# EAGLE design SparkFun_GPS_ZED-F9R_pHat (EAGLE 9.5.2)
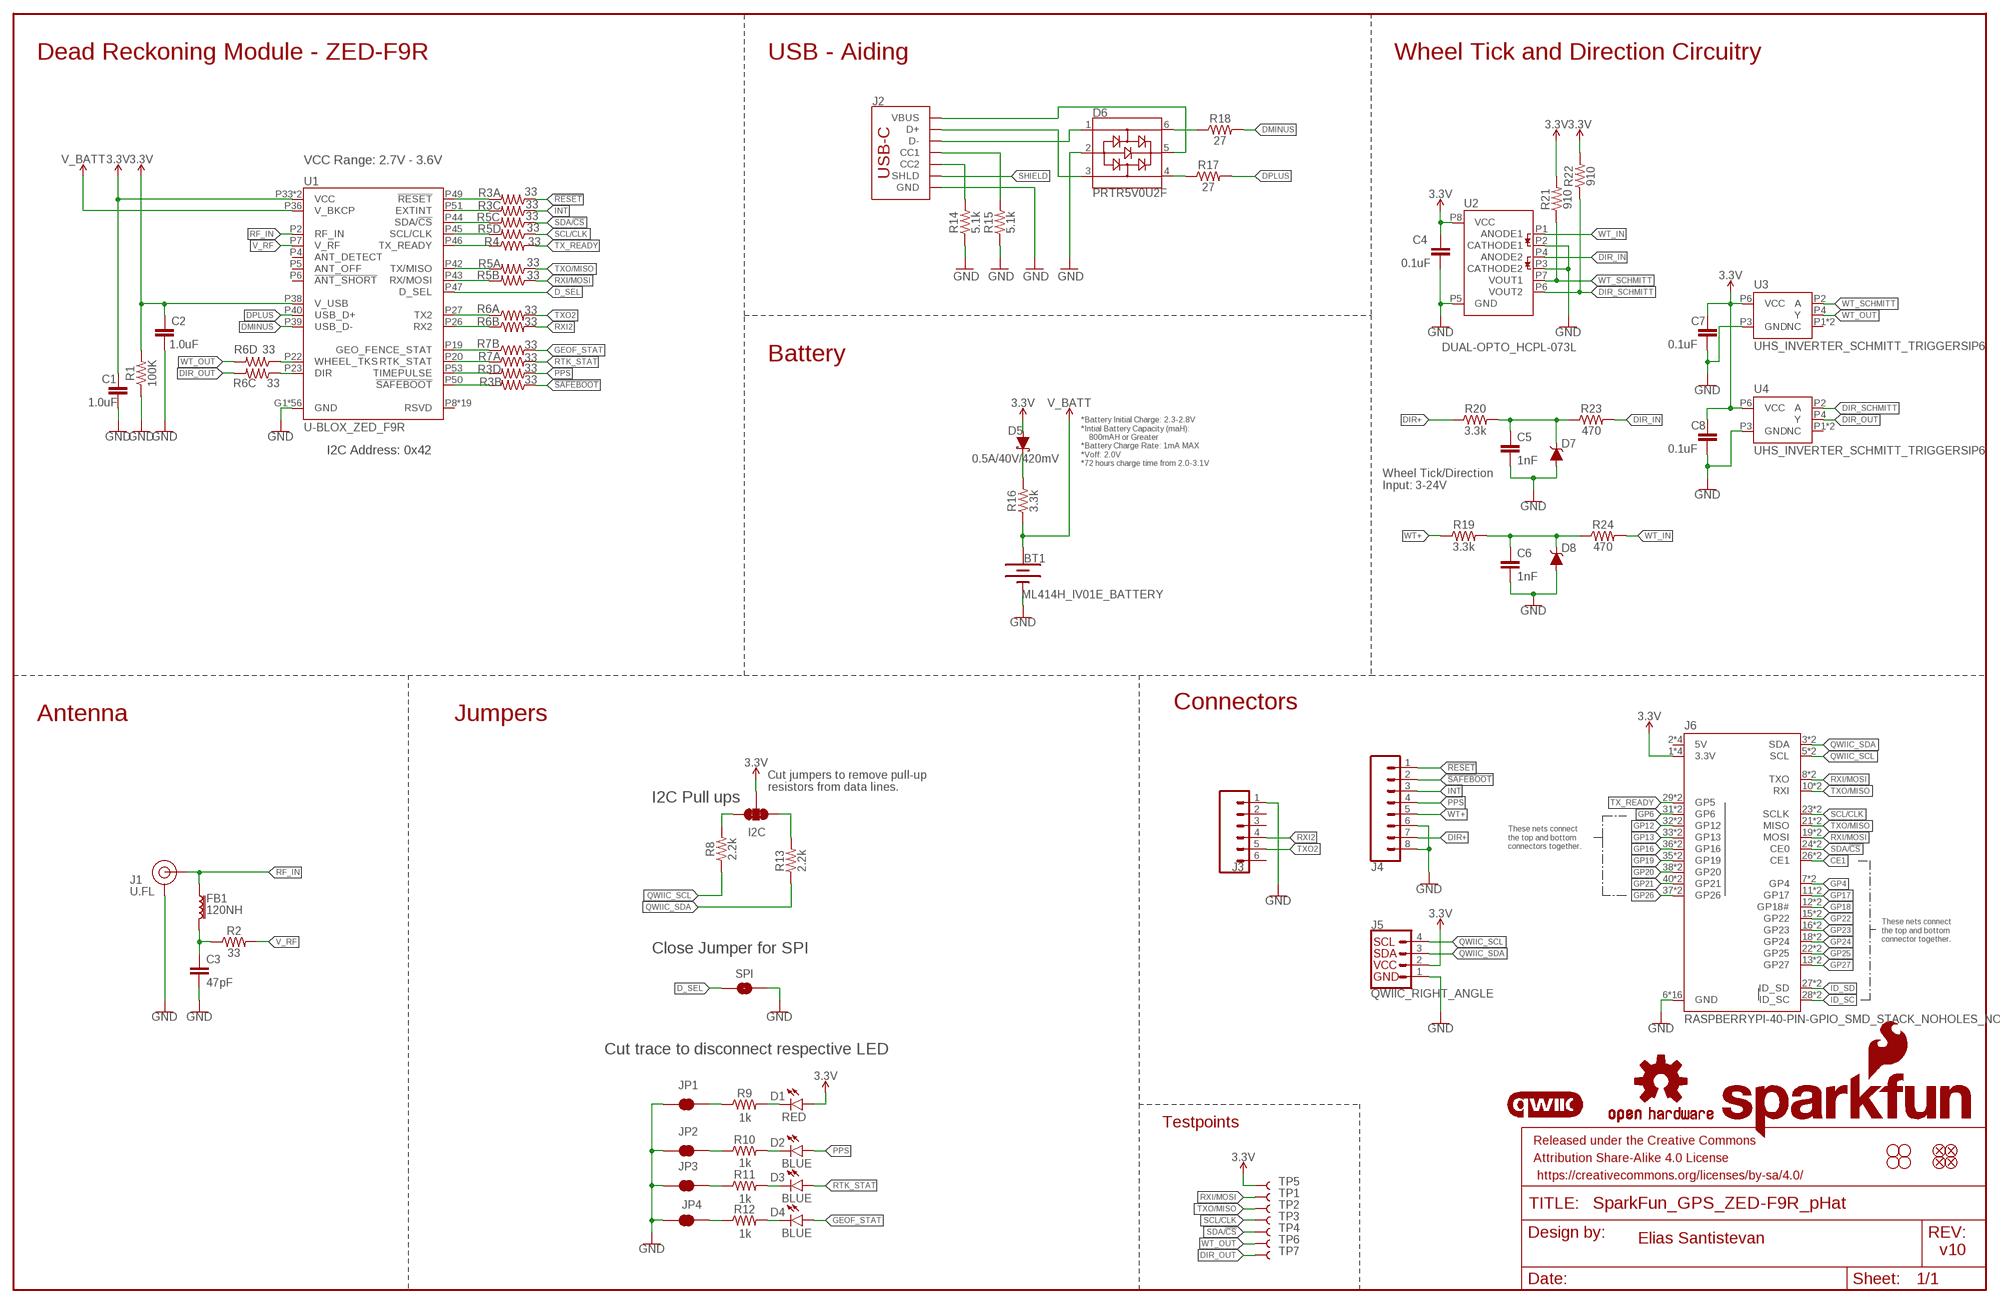
[diagram p0: schematic, sheet 1]

## Parts
BT1  ML414H_IV01E_BATTERY  [ML414H_IV01E]
C1  1.0uF  1.0UF-0402-16V-10%  [0402]
C2  1.0uF  1.0UF-0402-16V-10%  [0402]
C3  47pF  47PF-0402-25V-5%-X7R  [0402]
C4  0.1uF  0.1UF-0402-10V-10%-X7R  [0402]
C5  1nF  1.0NF/1000PF-0402-25V-10%-X7R  [0402]
C6  1nF  1.0NF/1000PF-0402-25V-10%-X7R  [0402]
C7  0.1uF  0.1UF-0402-10V-10%-X7R  [0402]
C8  0.1uF  0.1UF-0402-10V-10%-X7R  [0402]
D1  RED  LED-RED0603  [LED-0603]
D2  BLUE  LED-BLUE0603  [LED-0603]
D3  BLUE  LED-BLUE0603  [LED-0603]
D4  BLUE  LED-BLUE0603  [LED-0603]
D5  0.5A/40V/420mV  DIODE-SCHOTTKY-PMEG4005EJ  [SOD-323]
D6  PRTR5V0U2F  [SOT886]
D7  15V  DIODE-ZENER-BZX84C15LT3G  [SOT23-3]
D8  15V  DIODE-ZENER-BZX84C15LT3G  [SOT23-3]
FB1  120NH  FERRITE_BEAD_GNSS  [0402_MURATA]
FD1  FIDUCIALUFIDUCIAL  [FIDUCIAL-MICRO]
FD2  FIDUCIALUFIDUCIAL  [FIDUCIAL-MICRO]
FD3  FIDUCIALUFIDUCIAL  [FIDUCIAL-MICRO]
FD4  FIDUCIALUFIDUCIAL  [FIDUCIAL-MICRO]
FRAME1  FRAME-LEDGER  [CREATIVE_COMMONS]
H1  STAND-OFFTIGHT  [STAND-OFF-TIGHT]
H2  STAND-OFFTIGHT  [STAND-OFF-TIGHT]
H3  STAND-OFFTIGHT  [STAND-OFF-TIGHT]
H4  STAND-OFFTIGHT  [STAND-OFF-TIGHT]
J1  U.FL  U.FL2PIN  [U.FL]
J2  USB_C_2-LAYER  [USB-C-16P]
J3  CONN_06NO_SILK_NO_POP  [1X06_NO_SILK]
J4  CONN_08NO_SILK_FEMALE_PTH  [1X08_NO_SILK]
J5  QWIIC_RIGHT_ANGLE  QWIIC_CONNECTORJS-1MM  [JST04_1MM_RA]
J6  RASPBERRYPI-40-PIN-GPIO_SMD_STACK_NOHOLES_NOREF  [RASPBERRY_PI_HAT_40_PIN_SMD_STACKABLE_NOHOLES_NOREF]
JP1  JUMPER-SMT_2_NC_TRACE_SILK  [SMT-JUMPER_2_NC_TRACE_SILK]
JP2  JUMPER-SMT_2_NC_TRACE_SILK  [SMT-JUMPER_2_NC_TRACE_SILK]
JP3  JUMPER-SMT_2_NC_TRACE_SILK  [SMT-JUMPER_2_NC_TRACE_SILK]
JP4  JUMPER-SMT_2_NC_TRACE_SILK  [SMT-JUMPER_2_NC_TRACE_SILK]
JP5  JUMPER-SMT_2_NO_SILK  [SMT-JUMPER_2_NO_SILK]
JP6  JUMPER-SMT_3_2-NC_TRACE_SILK  [SMT-JUMPER_3_2-NC_TRACE_SILK]
LOGO1  QWIIC_LOGO_5MM  [QWIIC_5MM]
LOGO2  OSHW-LOGOM  [OSHW-LOGO-M]
LOGO3  SFE_LOGO_NAME_FLAME.2_INCH  [SFE_LOGO_NAME_FLAME_.2]
R1  100K  100KOHM-0402-1/16W-1%  [0402]
R2  33  33OHM-0603-1/10W-1%  [0603]
R3  33  33OHM_RA-1206-1/16W-5%  [1206_RA]
R4  33  33OHM-0603-1/10W-1%  [0603]
R5  33  33OHM_RA-1206-1/16W-5%  [1206_RA]
R6  33  33OHM_RA-1206-1/16W-5%  [1206_RA]
R7  33  33OHM_RA-1206-1/16W-5%  [1206_RA]
R8  2.2k  2.2KOHM-0603-1/10W-1%  [0603]
R9  1k  1KOHM-0603-1/10W-1%  [0603]
R10  1k  1KOHM-0603-1/10W-1%  [0603]
R11  1k  1KOHM-0603-1/10W-1%  [0603]
R12  1k  1KOHM-0603-1/10W-1%  [0603]
R13  2.2k  2.2KOHM-0603-1/10W-1%  [0603]
R14  5.1k  5.1KOHM-0402-1/16W-1%  [0402]
R15  5.1k  5.1KOHM-0402-1/16W-1%  [0402]
R16  3.3k  3.3KOHM-0603-1/10W-1%  [0603]
R17  27  27OHM-0603-1/10W-1%  [0603]
R18  27  27OHM-0603-1/10W-1%  [0603]
R19  3.3k  3.3KOHM-0603-1/10W-1%  [0603]
R20  3.3k  3.3KOHM-0603-1/10W-1%  [0603]
R21  910  910OHM-0603-1/10W-5%  [0603]
R22  910  910OHM-0603-1/10W-5%  [0603]
R23  470  470OHM-0603-1/10W-1%  [0603]
R24  470  470OHM-0603-1/10W-1%  [0603]
TP1  TEST-POINT3X4  [PAD.03X.04]
TP2  TEST-POINT3X4  [PAD.03X.04]
TP3  TEST-POINT3X4  [PAD.03X.04]
TP4  TEST-POINT3X4  [PAD.03X.04]
TP5  TEST-POINT3X4  [PAD.03X.04]
TP6  TEST-POINT3X4  [PAD.03X.04]
TP7  TEST-POINT3X4  [PAD.03X.04]
U1  U-BLOX_ZED_F9R  [UBLOX_ZED_F9R]
U2  DUAL-OPTO_HCPL-073L  [SOP_8-PIN]
U3  UHS_INVERTER_SCHMITT_TRIGGERSIP6  [SIP6]
U4  UHS_INVERTER_SCHMITT_TRIGGERSIP6  [SIP6]

## Nets
3.3V: C1.1 C2.1 C4.1 C7.1 C8.1 D1.A D5.A J5.2 J6.1(3.3V) J6.1B(3.3V) J6.17(3.3V) J6.17B(3.3V) JP6.2 R1.2 R21.2 R22.2 TP5.P$1 U1.P33(VCC) U1.P34(VCC) U1.P38(V_USB) U2.P8(VCC) U3.P6(VCC) U4.P6(VCC)
!RESET: J4.1 R3.P1
!SAFEBOOT: J4.2 R3.P2
CE1: J6.26(CE1) J6.26B(CE1)
D_SEL: JP5.1 U1.P47(D_SEL)
DIR+: J4.7 R20.1
DIR_IN: R23.2 U2.P4(ANODE2)
DIR_OUT: R6.P6 TP7.P$1 U4.P4(Y)
DIR_SCHMITT: R22.1 U2.P6(VOUT2) U4.P2(A)
DMINUS: R18.2 U1.P39(USB_D-)
DPLUS: R17.2 U1.P40(USB_D+)
GEOF_STAT: D4.A R7.P7
GND: BT1.- C1.2 C2.2 C3.2 C4.2 C5.2 C6.2 C7.2 C8.2 D6.2 D7.1(A) D8.1(A) J1.1(GND) J1.2(GND) J2.GND J2.GND2(GND) J3.1 J4.6 J4.8 J5.1 J6.6(GND) J6.6B(GND) J6.9(GND) J6.9B(GND) J6.14(GND) J6.14B(GND) J6.20(GND) J6.20B(GND) J6.25(GND) J6.25B(GND) J6.30(GND) J6.30B(GND) J6.34(GND) J6.34B(GND) J6.39(GND) J6.39B(GND) JP1.1 JP2.1 JP3.1 JP4.1 JP5.2 R1.1 R14.1 R15.1 U1.G1(GND) U1.G2(GND) U1.G3(GND) U1.G4(GND) U1.G5(GND) U1.G6(GND) U1.G7(GND) U1.G8(GND) U1.G9(GND) U1.G10(GND) U1.G11(GND) U1.G12(GND) U1.G13(GND) U1.G14(GND) U1.G15(GND) U1.G16(GND) U1.G17(GND) U1.G18(GND) U1.G19(GND) U1.G20(GND) U1.G21(GND) U1.G22(GND) U1.G23(GND) U1.G24(GND) U1.G25(GND) U1.G26(GND) U1.G27(GND) U1.G28(GND) U1.G29(GND) U1.G30(GND) U1.G31(GND) U1.G32(GND) U1.G33(GND) U1.G34(GND) U1.G35(GND) U1.G36(GND) U1.G37(GND) U1.G38(GND) U1.G39(GND) U1.G40(GND) U1.G41(GND) U1.G42(GND) U1.G43(GND) U1.G44(GND) U1.G45(GND) U1.G46(GND) U1.G47(GND) U1.G48(GND) U1.P1(GND) U1.P3(GND) U1.P12(GND) U1.P14(GND) U1.P32(GND) U1.P37(GND) U1.P41(GND) U1.P48(GND) U2.P2(CATHODE1) U2.P3(CATHODE2) U2.P5(GND) U3.P3(GND) U4.P3(GND)
GP4: J6.7(GP4) J6.7B(GP4)
GP6: J6.31(GP6) J6.31B(GP6)
GP12: J6.32(GP12) J6.32B(GP12)
GP13: J6.33(GP13) J6.33B(GP13)
GP16: J6.36(GP16) J6.36B(GP16)
GP17: J6.11(GP17) J6.11B(GP17)
GP18: J6.12(GP18#) J6.12B(GP18#)
GP19: J6.35(GP19) J6.35B(GP19)
GP20: J6.38(GP20) J6.38B(GP20)
GP21: J6.40(GP21) J6.40B(GP21)
GP22: J6.15(GP22) J6.15B(GP22)
GP23: J6.16(GP23) J6.16B(GP23)
GP24: J6.18(GP24) J6.18B(GP24)
GP25: J6.22(GP25) J6.22B(GP25)
GP26: J6.37(GP26) J6.37B(GP26)
GP27: J6.13(GP27) J6.13B(GP27)
ID_SC: J6.28(ID_SC) J6.28B(ID_SC)
ID_SD: J6.27(ID_SD) J6.27B(ID_SD)
INT: J4.3 R3.P3
N$1: JP6.1 R13.2
N$2: D5.C R16.2
N$3: JP6.3 R8.2
N$4: D1.C R9.2
N$5: C3.1 FB1.P2 R2.1
N$6: D6.6 R18.1
N$7: D6.4 R17.1
N$8: JP1.2 R9.1
N$9: D6.3 J2.A6(D+) J2.B6(D+)
N$10: D6.5 J2.VBUS1(VBUS) J2.VBUS2(VBUS)
N$11: D6.1 J2.A7(D-) J2.B7(D-)
N$12: J2.B5(CC2) R14.2
N$13: R3.P8 U1.P49(!RESET!)
N$14: R3.P6 U1.P51(EXTINT)
N$15: R5.P6 U1.P44(SDA/!CS!)
N$16: JP4.2 R12.1
N$17: D4.C R12.2
N$18: J2.A5(CC1) R15.2
N$19: R5.P5 U1.P45(SCL/CLK)
N$20: R4.1 U1.P46(TX_READY)
N$21: R5.P8 U1.P42(TX/MISO)
N$22: JP3.2 R11.1
N$23: JP2.2 R10.1
N$24: D2.C R10.2
N$25: D3.C R11.2
N$26: R5.P7 U1.P43(RX/MOSI)
N$27: C6.1 D8.3(C) R19.2 R24.1
N$28: R7.P2 U1.P19(GEO_FENCE_STAT)
N$29: R7.P1 U1.P20(RTK_STAT)
N$30: R3.P5 U1.P53(TIMEPULSE)
N$31: R3.P7 U1.P50(!SAFEBOOT!)
N$32: R6.P1 U1.P27(TX2)
N$33: R6.P2 U1.P26(RX2)
N$34: R6.P4 U1.P22(WHEEL_TKS)
N$35: R6.P3 U1.P23(DIR)
N$36: C5.1 D7.3(C) R20.2 R23.1
PPS: D2.A J4.4 R3.P4
QWIIC_SCL: J5.4 J6.5(SCL) J6.5B(SCL) R8.1
QWIIC_SDA: J5.3 J6.3(SDA) J6.3B(SDA) R13.1
RF_IN [Antenna]: FB1.P1 J1.FEED(SIGNAL) U1.P2(RF_IN)
RTK_STAT: D3.A R7.P8
RXI2: J3.4 R6.P7
RXI/MOSI: J6.8(TXO) J6.8B(TXO) J6.19(MOSI) J6.19B(MOSI) R5.P2 TP1.P$1
SCL/CLK: J6.23(SCLK) J6.23B(SCLK) R5.P4 TP3.P$1
SDA/!CS: J6.24(CE0) J6.24B(CE0) R5.P3 TP4.P$1
SHIELD: J2.SHLD1(SHLD) J2.SHLD2(SHLD) J2.SHLD3(SHLD) J2.SHLD4(SHLD) J2.SHLD5(SHLD) J2.SHLD6(SHLD) J2.SHLD7(SHLD) J2.SHLD8(SHLD)
TX_READY: J6.29(GP5) J6.29B(GP5) R4.2
TXO2: J3.5 R6.P8
TXO/MISO: J6.10(RXI) J6.10B(RXI) J6.21(MISO) J6.21B(MISO) R5.P1 TP2.P$1
V_BATT: BT1.+ R16.1 U1.P36(V_BKCP)
V_RF: R2.2 U1.P7(V_RF)
WT+: J4.5 R19.1
WT_IN: R24.2 U2.P1(ANODE1)
WT_OUT: R6.P5 TP6.P$1 U3.P4(Y)
WT_SCHMITT: R21.1 U2.P7(VOUT1) U3.P2(A)
Unconnected: J3.2 J3.3 J3.6 R7.P3 R7.P4 R7.P5 R7.P6 U1.P4(ANT_DETECT) U1.P5(ANT_OFF) U1.P6(!ANT_SHORT!) U1.P8(RSVD) U1.P9(RSVD) U1.P10(RSVD) U1.P11(RSVD) U1.P13(RSVD) U1.P15(RSVD) U1.P16(RSVD) U1.P17(RSVD) U1.P18(RSVD) U1.P21(RSVD) U1.P24(RSVD) U1.P25(RSVD) U1.P28(RSVD) U1.P29(RSVD) U1.P30(RSVD) U1.P31(RSVD) U1.P35(RSVD) U1.P52(RSVD) U1.P54(RSVD) U3.P1(NC) U3.P5(NC) U4.P1(NC) U4.P5(NC)

## Notes on the sheet
- Dead Reckoning Module - ZED-F9R | USB - Aiding | Wheel Tick and Direction Circuitry
- VCC Range: 2.7V - 3.6V
- Battery
- I2C Address: 0x42
- *Battery Initial Charge: 2.3-2.8V
  *Intial Battery Capacity (maH): 
      800mAH or Greater
  *Battery Charge Rate: 1mA MAX
  *Voff: 2.0V
  *72 hours charge time from 2.0-3.1V
- Wheel Tick/Direction
  Input: 3-24V
- Connectors
- Antenna | Jumpers
- Cut jumpers to remove pull-up
  resistors from data lines.
- I2C Pull ups
- I2C
- These nets connect
  the top and bottom
  connectors together.
- These nets connect 
  the top and bottom 
  connector together.
- Close Jumper for SPI
- SPI
- Cut trace to disconnect respective LED
- 1k
- Testpoints
- 1k
- 1k
- 1k
- Elias Santistevan
- v10

## Power pins joined to a net without a drawn wire
5V: J6.2(5V) J6.2B(5V) J6.4(5V) J6.4B(5V)

## Library data of the parts
BT1 = SparkFun-Batteries:ML414H_IV01E_BATTERY: SEIKO ML414H-IV01E Reflowable Lithium Battery ML414H is a rechargeable, coin type battery with features such as Pb-free reflowable (Peak temperature: 260 C) and high temperature heat resistance. Battery Characteristics: 3.1V max voltage Voff is 2V 1mAH 3k series resistor with battery 72 hour charge time from 2.0-3.1V 2.3-2.8V initial charge; PROD_ID: BATT-14267
C1 C2 = SparkFun-Capacitors:1.0UF: 1µF ceramic capacitors A capacitor is a passive two-terminal electrical component used to store electrical energy temporarily in an electric field.; PROD_ID: CAP-12417
C3 = SparkFun-Capacitors:47PF: 47pF ceramic capacitors A capacitor is a passive two-terminal electrical component used to store electrical energy temporarily in an electric field.; PROD_ID: CAP-15063
C4 C7 C8 = SparkFun-Capacitors:0.1UF: 0.1µF ceramic capacitors A capacitor is a passive two-terminal electrical component used to store electrical energy temporarily in an electric field.; PROD_ID: CAP-15083
C5 C6 = SparkFun-Capacitors:1.0NF/1000PF: 1nF/1,000pF ceramic capacitors A capacitor is a passive two-terminal electrical component used to store electrical energy temporarily in an electric field.; PROD_ID: CAP-15061
D1 = SparkFun-LED:LED-RED: Red SMD LED Used in manufacturing of most products at SparkFun Packages: 0603 - SMD 0603 package [Product Link] <http://docs.avagotech.com/docs/AV02-0551EN> 0603 SMART - SMD 0603 SMART package ( more efficient and expensive)[Product Link] <http://www.osram-os.com/Graphics/XPic2/00077099_0.pdf> 1206 - SMD1206 package [Product Link] <https://www.sparkfun.com/datasheets/DevTools/LilyPad/Q150OVS4.pdff> SparkFun Products: Pro Mini 328 -5V <https://www.sparkfun.com/products/821> RedBoard <https://www.sparkfun.com/products/12757> IOIO-OTG <https://www.sparkfun.com/products/13613>; PROD_ID: DIO-00819
D2-D4 = SparkFun-LED:LED-BLUE: Blue SMD LED Used in manufacturing of various products at SparkFun Packages: 0603 - SMD 0603 package [Product Link] <http://www.digikey.com/product-detail/en/SMLE12BC7TT86/511-1589-2-ND/1641808> 1206 - SMD1206 package [Product Link] <http://www.digikey.com/product-detail/en/lite-on-inc/LTST-C150TBKT/160-1643-1-ND/573584> SparkFun Products: ESP8266 Thing-Dev Board <https://www.sparkfun.com/products/13711> RedBoard <https://www.sparkfun.com/products/12757>; PROD_ID: DIO-08575
D5 = SparkFun-DiscreteSemi:DIODE-SCHOTTKY: Schottky diode A Schottky diode is a semiconductor diode which has a low forward voltage drop and a very fast switching action.; PROD_ID: DIO-10955
D6 = SparkFun-IC-Power:PRTR5V0U2: A small ESD protection device. Most commonly used on USB D+/D- signals to protect large, expensive, or especially sensitive USB enabled devices.; PROD_ID: DIO-14084
D7 D8 = SparkFun-DiscreteSemi:DIODE-ZENER: Zener Diode A Zener diode allows current to flow from its anode to its cathode like a normal semiconductor diode, but it also permits current to flow in the reverse direction when its "Zener voltage" is reached. - WIkipedia; PROD_ID: DIO-15071
FB1 = SparkFun-Coils:FERRITE_BEAD_GNSS; PROD_ID: NDUC-15072
FD1-FD4 = SparkFun-Aesthetics:FIDUCIAL: Fiducial Alignment Points Point-of-reference for pick-and-place machines and other optical instruments.
FRAME1 = SparkFun-Aesthetics:FRAME-LEDGER: Schematic Frame - Ledger Standard 11x14 US Ledger frame
H1-H4 = SparkFun-Hardware:STAND-OFF: Stand Off Drill holes for mechanically mounting via screws, standoffs, etc. Note: Use the keepout ring to avoid running the screw head into surrounding components. Variant Overviews STAND-OFF - Mechanical footprint for a #4 phillips button head screw. STAND-OFF-TIGHT - Mechanical footprint for a #4 phillips button head screw, Example SparkFun Products Screw - Phillips Head (1/4", 4-40, 10 pack) <https://www.sparkfun.com/products/10453> (PRT-10453) Screw - Phillips Head (1/2", 4-40, 10 pack) <https://www.sparkfun.com/products/10452> (PRT-10452) Screw - Phillips Head (3/4", 4-40, 10 pack) <https://www.sparkfun.com/products/10451> (PRT-10451) Screw - Phillips Head (1", 4-40, 10 pack) <https://www.sparkfun.com/products/10450> (PRT-10450)
J1 = SparkFun-Connectors:U.FL2PIN: SMD Antenna Connector - U.FL 2mm height, 3.0mm x 3.0mm receptacle size. SparkFun Products: SparkFun WiFi Shield - ESP8266 <https://www.sparkfun.com/products/13287> SparkFun ESP8266 Thing <https://www.sparkfun.com/products/13231> SparkFun MiniGen - Pro Mini Signal Generator Shield <https://www.sparkfun.com/products/11420>; PROD_ID: CONN-09193; SF_ID: WRL-09144
J2 = SparkFun-Connectors:USB_C: USB Type C 16Pin Connector Super Speed pins not available on the 16-pin purely SMD connector so this part is best for USB 2.0 implementations. D1 and D2 are tied together enabling D+/- no matter which way the cable is plugged into the connector. The two channel configuration pins (CC1/2) are exposed. These are normally connected to ground via 5.1k resistors but can be reconfigured for high current/high power applications.; PROD_ID: CONN-14122
J3 = SparkFun-Connectors:CONN_06: Multi connection point. Often used as Generic Header-pin footprint for 0.1 inch spaced/style header connections On any of the 0.1 inch spaced packages, you can populate with these: Break Away Headers - Straight <https://www.sparkfun.com/products/116> (PRT-00116) Break Away Male Headers - Right Angle <https://www.sparkfun.com/products/553> (PRT-00553) Female Headers <https://www.sparkfun.com/products/115> (PRT-00115) Break Away Headers - Machine Pin <https://www.sparkfun.com/products/117> (PRT-00117) Break Away Female Headers - Swiss Machine Pin <https://www.sparkfun.com/products/743> (PRT-00743) Arduino Stackable Header - 6 Pin <https://www.sparkfun.com/products/9280> (PRT-09280) For SCREWTERMINALS and SPRING TERMINALS visit here: Screw Terimnals on SparkFun.com <https://www.sparkfun.com/search/results?term=Screw+Terminals> (5mm/3.5mm/2.54mm spacing) This device is also useful as a general connection point to wire up your design to another part of your project. Our various solder wires solder well into these plated through hole pads. Hook-Up Wire - Assortment (Stranded, 22 AWG) <https://www.sparkfun.com/products/11375> (PRT-11375) Hook-Up Wire - Assortment (Solid Core, 22 AWG) <https://www.sparkfun.com/products/11367> (PRT-11367) View the entire wire category on our website here <https://www.sparkfun.com/categories/141>
J4 = SparkFun-Connectors:CONN_08: Multi connection point. Often used as Generic Header-pin footprint for 0.1 inch spaced/style header connections On any of the 0.1 inch spaced packages, you can populate with these: Break Away Headers - Straight <https://www.sparkfun.com/products/116> (PRT-00116) Break Away Male Headers - Right Angle <https://www.sparkfun.com/products/553> (PRT-00553) Female Headers <https://www.sparkfun.com/products/115> (PRT-00115) Break Away Headers - Machine Pin <https://www.sparkfun.com/products/117> (PRT-00117) Break Away Female Headers - Swiss Machine Pin <https://www.sparkfun.com/products/743> (PRT-00743) Arduino Stackable Header - 8 Pin <https://www.sparkfun.com/products/9279> (PRT-09279) For SCREWTERMINALS and SPRING TERMINALS visit here: Screw Terimnals on SparkFun.com <https://www.sparkfun.com/search/results?term=Screw+Terminals> (5mm/3.5mm/2.54mm spacing) This device is also useful as a general connection point to wire up your design to another part of your project. Our various solder wires solder well into these plated through hole pads. Hook-Up Wire - Assortment (Stranded, 22 AWG) <https://www.sparkfun.com/products/11375> (PRT-11375) Hook-Up Wire - Assortment (Solid Core, 22 AWG) <https://www.sparkfun.com/products/11367> (PRT-11367) View the entire wire category on our website here <https://www.sparkfun.com/categories/141> Special notes: Molex polarized connector foot print use with SKU : PRT-08231 with associated crimp pins and housings. 1MM SMD Version SKU: PRT-10208 NOTES ON THE VARIANTS LOCK and LOCK_LONGPADS... This footprint was designed to help hold the alignment of a through-hole component (i.e. 6-pin header) while soldering it into place. You may notice that each hole has been shifted either up or down by 0.005 of an inch from it's more standard position (which is a perfectly straight line). This slight alteration caused the pins (the squares in the middle) to touch the edges of the holes. Because they are alternating, it causes a "brace" to hold the component in place. 0.005 has proven to be the perfect amount of "off-center" position when using our standard breakaway headers. Although looks a little odd when you look at the bare footprint, once you have a header in there, the alteration is very hard to notice. Also,if you push a header all the way into place, it is covered up entirely on the bottom side.; PROD_ID: CONN-08438
J5 = SparkFun-Connectors:QWIIC_CONNECTOR: SparkFun I2C Standard Qwiic Connector An SMD 1mm pitch JST connector makes it easy and quick (get it? Qwiic?) to connect I2C devices to each other. The Qwiic system <http://www.sparkfun.com/qwiic> enables fast and solderless connection between popular platforms and various sensors and actuators. We carry 200mm <https://www.sparkfun.com/products/14204>, 100mm <https://www.sparkfun.com/products/14205>, 50mm <https://www.sparkfun.com/products/14206>, and breadboard friendly <https://www.sparkfun.com/products/14207> Qwiic cables. We also offer 10 pcs strips <https://www.sparkfun.com/products/14323> the SMD connectors.; PROD_ID: CONN-13694
J6 = SparkFun-Connectors:RASPBERRYPI-40-PIN-GPIO: Raspberry Pi GPIO Header 2x20 pin connector, as found on B, B+, A+ models. Both shrouded PTH and SMT versions available. SparkFun Products: GPIO Shrouded Header <https://www.sparkfun.com/products/13054>- PTH SparkFun Pi Wedge (Preassembled) <https://www.sparkfun.com/products/13717>
JP1-JP4 = SparkFun-Jumpers:JUMPER-SMT_2_NC_TRACE: Normally closed trace jumper This jumper has a trace between two pads so it's normally closed (NC). Use a razor knife to open the connection. For best results follow the IPC guidelines for cutting traces: Cutout at least 0.063 mm (0.005 in). Remove all loose material to clean up the cut area. Seal the cut with an approved epoxy. Reapply solder to reclose the connection.
JP5 = SparkFun-Jumpers:JUMPER-SMT_2_NO: Normally open jumper This jumper has two pads in close proximity to each other. Apply solder to close the connection. Round pads are easier to solder for beginners, but are a lot larger. SparkFun Product that uses the round pads: SparkFun EL Sequencer <https://www.sparkfun.com/products/12781>
JP6 = SparkFun-Jumpers:JUMPER-SMT_3_2-NC_TRACE: Normally closed trace jumper (2 of 2 connections) This jumper has a trace between all three pads so they are normally closed (NC). Use a razor knife to open the connection(s). For best results follow the IPC guidelines for cutting traces: Cutout at least 0.063 mm (0.005 in). Remove all loose material to clean up the cut area. Seal the cut with an approved epoxy. Reapply solder to reclose the connection(s).
LOGO1 = SparkFun-Aesthetics:QWIIC_LOGO: Qwiic Logos for placement on schematic and PCB. The 5.5mm silk logo is best for placing next to Qwiic connector.
LOGO2 = SparkFun-Aesthetics:OSHW-LOGO: Open-Source Hardware (OSHW) Logo This logo indicates the piece of hardware it is found on incorporates a OSHW license and/or adheres to the definition of open source hardware found here: http://freedomdefined.org/OSHW
LOGO3 = SparkFun-Aesthetics:SFE_LOGO_NAME_FLAME: SparkFun Font Logo w/ Flame This is the SparkFun full logo. The logo on the schematic will always be the same size; the package variant is the height of the flame part of the logo. Default layer for the logo on the board is tSilk.
R1 = SparkFun-Resistors:100KOHM: 100kΩ resistor A resistor is a passive two-terminal electrical component that implements electrical resistance as a circuit element. Resistors act to reduce current flow, and, at the same time, act to lower voltage levels within circuits. - Wikipedia; PROD_ID: RES-13495
R2 R4 = SparkFun-Resistors:33OHM: 33Ω resistor A resistor is a passive two-terminal electrical component that implements electrical resistance as a circuit element. Resistors act to reduce current flow, and, at the same time, act to lower voltage levels within circuits. - Wikipedia; PROD_ID: RES-08270
R3 R5-R7 = SparkFun-Resistors:33OHM_RA: EXB-38V330JV Four Resistory Array - AEC-Q200 Certified; PROD_ID: RES-15081
R8 R13 = SparkFun-Resistors:2.2KOHM: 2.2kΩ resistor A resistor is a passive two-terminal electrical component that implements electrical resistance as a circuit element. Resistors act to reduce current flow, and, at the same time, act to lower voltage levels within circuits. - Wikipedia; PROD_ID: RES-08272
R9-R12 = SparkFun-Resistors:1KOHM: 1kΩ resistor A resistor is a passive two-terminal electrical component that implements electrical resistance as a circuit element. Resistors act to reduce current flow, and, at the same time, act to lower voltage levels within circuits. - Wikipedia; PROD_ID: RES-07856
R14 R15 = SparkFun-Resistors:5.1KOHM; PROD_ID: RES-14340
R16 R19 R20 = SparkFun-Resistors:3.3KOHM: 3.3kΩ resistor A resistor is a passive two-terminal electrical component that implements electrical resistance as a circuit element. Resistors act to reduce current flow, and, at the same time, act to lower voltage levels within circuits. - Wikipedia; PROD_ID: RES-07851
R17 R18 = SparkFun-Resistors:27OHM: 27Ω resistor A resistor is a passive two-terminal electrical component that implements electrical resistance as a circuit element. Resistors act to reduce current flow, and, at the same time, act to lower voltage levels within circuits. - Wikipedia; PROD_ID: RES-09334
R21 R22 = SparkFun-Resistors:910OHM: 910 Ohm Resistor A resistor is a passive two-terminal electrical component that implements electrical resistance as a circuit element. Resistors act to reduce current flow, and, at the same time, act to lower voltage levels within circuits. - Wikipedia Digikey Link <https://www.digikey.com/product-detail/en/yageo/RC0603JR-07910RL/311-910GRTR-ND/726838>; PROD_ID: RES-13860
R23 R24 = SparkFun-Resistors:470OHM: 470Ω resistor A resistor is a passive two-terminal electrical component that implements electrical resistance as a circuit element. Resistors act to reduce current flow, and, at the same time, act to lower voltage levels within circuits. - Wikipedia; PROD_ID: RES-07869
TP1-TP7 = SparkFun-Connectors:TEST-POINT: SparkFun Test Points Bare copper test points for troubleshooting or In-Circuit-Testing. These are used by our Production team for verifying production board runs using pogo-pins on test beds. SparkFun Products: SparkFun LSM9DS1 Breakout <https://www.sparkfun.com/products/13284> SparkFun PSOC <https://www.sparkfun.com/products/13714> SparkFun Load Cell Amplifier <https://www.sparkfun.com/products/13879>
U1 = SparkFun-GPS:U-BLOX_ZED_F9R: u-blox ZED-F9K ADR GPS Unit with Real Time Kinematics (RTK) and internal IMU = Automotive Dead Reckoning; PROD_ID: IC-14716
U2 = SparkFun-DiscreteSemi:DUAL-OPTO_HCPL-073L: HCPL-073L These high gain series couplers use a Light Emitting Diode and an integrated high gain photodetector to provide extremely high current transfer ratio between input and output. Separate pins for the photodiode and output stage result in LVTTL compatible saturation voltages and high speed operation. Where desired, the VCC and VO terminals may be tied together to achieve conventional photo-darlington operation. A base access terminal allows a gain bandwidth adjustment to be made. These optocouplers are for use in LVTTL/LVCMOS or other low power applications. A 400% minimum current transfer ratio is guaranteed over 0 to +70˚C operating range for only 0.5 mA of LED current. Digikey Link <https://www.digikey.com/product-detail/en/broadcom-limited/HCPL-073L-500E/516-4204-2-ND/1234512>; PROD_ID: IC-15070
U3 U4 = SparkFun-IC-Amplifiers:UHS_INVERTER_SCHMITT_TRIGGER: NC7SZ14 The NC7SZ14 is a single inverter with Schmitt trigger input from ON Semiconductor’s Ultra−High Speed (UHS) series of TinyLogic. The device is fabricated w ith advanced CMOS technology to achieve ultra−high speed with high output drive while maintaining low static power dissipation over a very broad VCC operating range. The device is specified to operate over the 1.65 V to 5.5 V VCC range. The inputs and outputs are high−impedance when VCC is 0 V. Inputs tolerate voltages up to 5.5 V independent of VCC operating voltage. Digikey Link <https://www.digikey.com/product-detail/en/on-semiconductor/NC7SZ14M5X/NC7SZ14M5XDKR-ND/1628606>; PROD_ID: IC-15068

## Net classes
1 Antenna: width 1 mm, clearance 0.3 mm

## Board
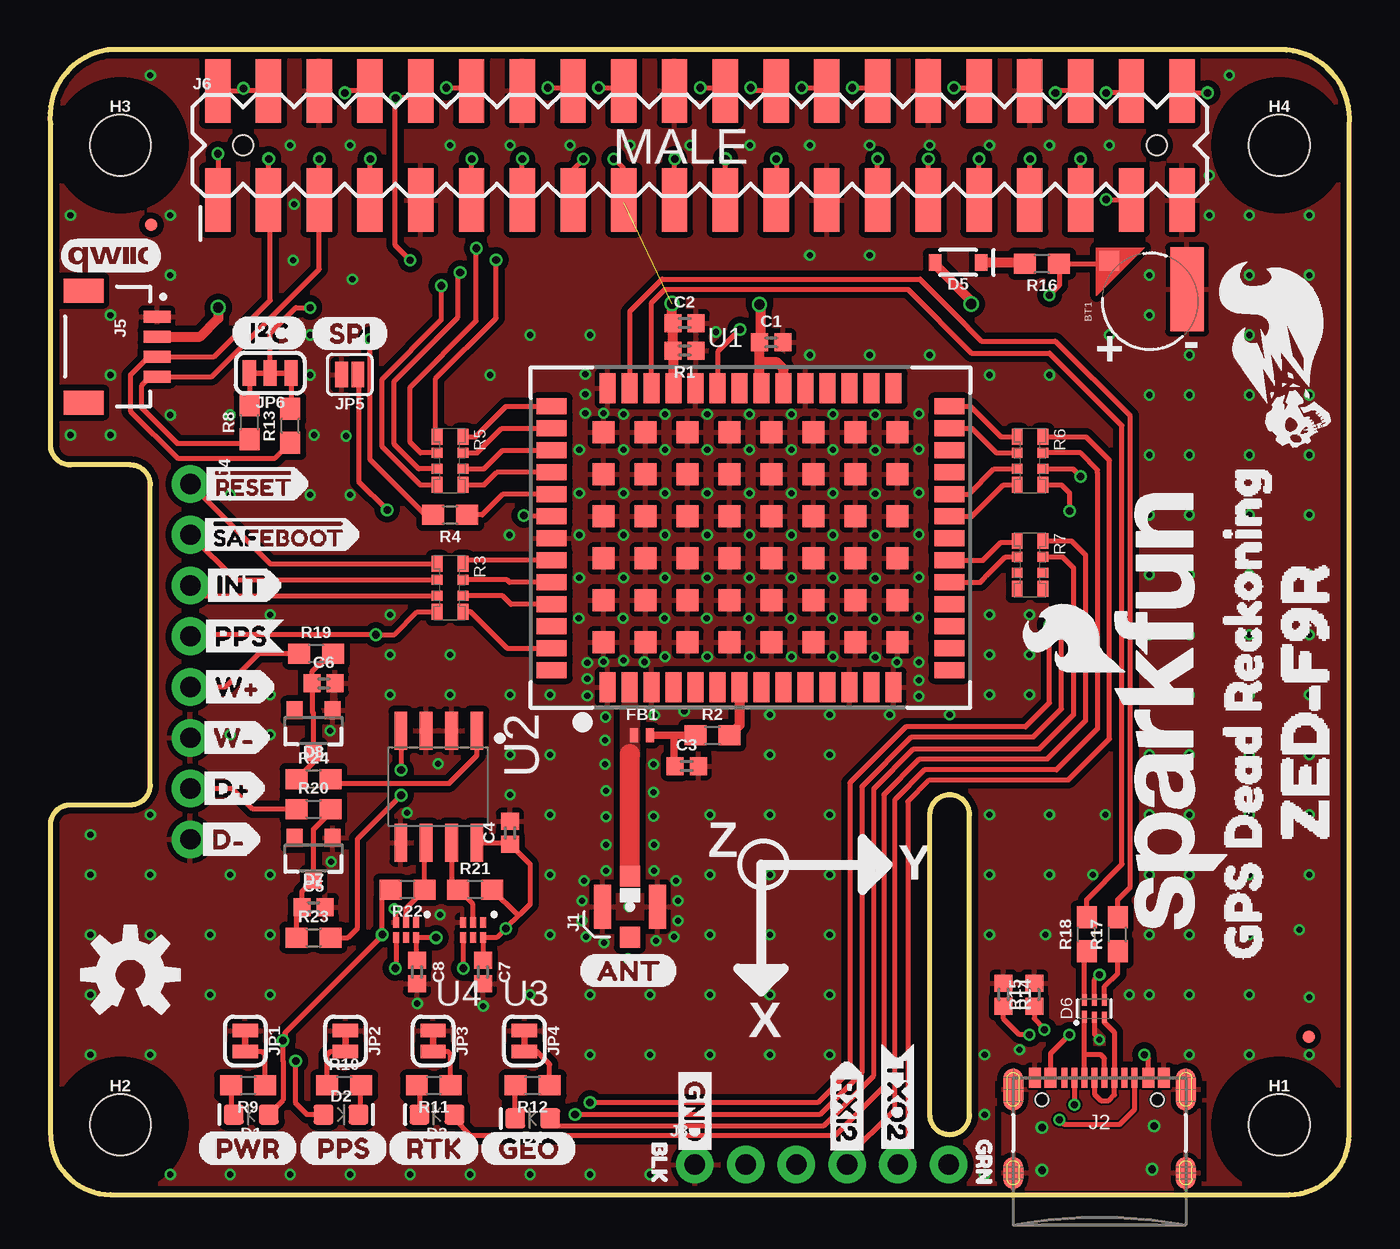
[diagram p1: board, top side]
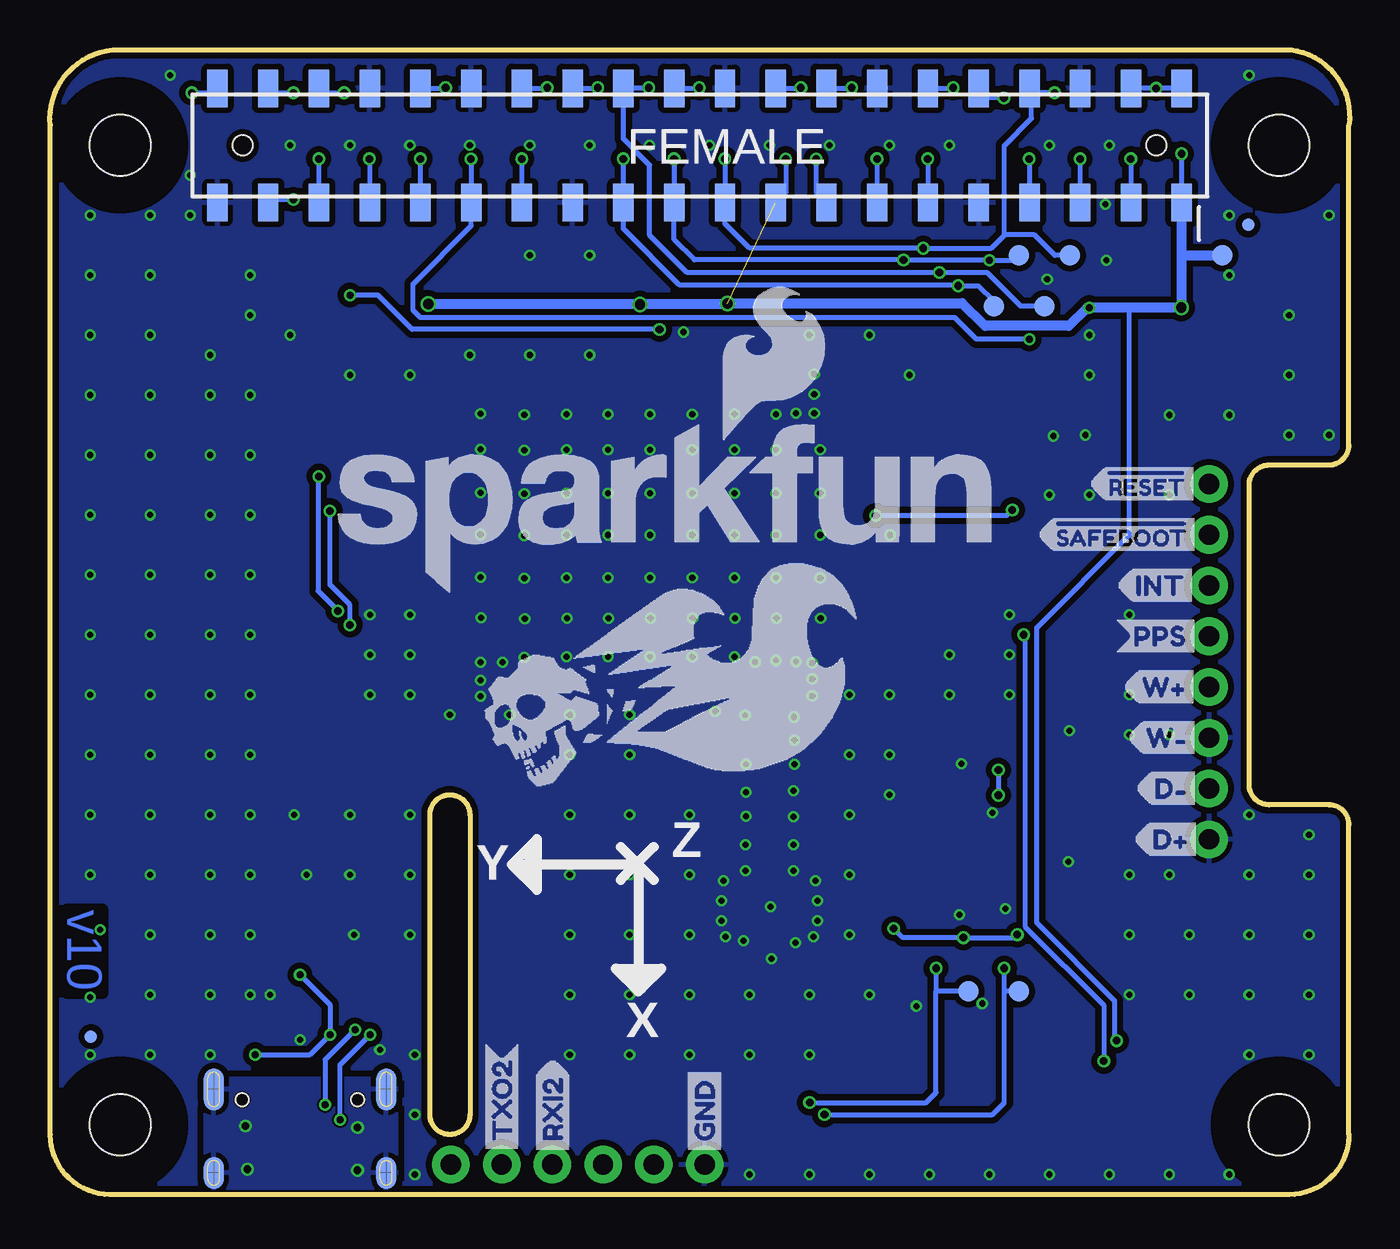
[diagram p2: board, bottom side, seen from below]

Size 65.04 x 57.26 mm. Coordinates in mm from the lower left corner, seen from the top.
Outline: 3.03,0 62.03,0 arc90 65.03,3 65.03,53.5 arc90 61.9,57.26 2.9,57.26 arc90 0.03,53.5 0.03,37.5 arc90 1.03,36.5 4.03,36.5 arc-90 5.03,35.5 5.03,20.5 arc-90 4.03,19.5 1.03,19.5 arc90 0.03,18.5 0.03,3 arc90 3.03,0
Outline: 45.03,3 arc90 46.03,4 46.03,19 arc90 45.03,20 arc90 44.03,19 44.03,4 arc90 45.03,3
Copper layers (1*16): Top 0.035mm / dielectric 1.5mm / Bottom 0.035mm
Design rules "SparkFun-2-layer-FAB-LIMIT": minimum track width 4mil, minimum drill 6mil, track to track 4mil, track to pad 4mil, pad to pad 4mil, via to via 4mil, smd to smd 4mil, copper to edge 4mil, drill to drill 4mil, minimum pad ring 5mil, minimum via ring 5mil, stop-mask expansion 4mil, vias tented up to drill 25mil, thermal gap 10mil
tRestrict: area 58.4,0.4 to 64.6,6.6; area 0.4,0.4 to 6.6,6.6; area 0.4,49.4 to 6.6,55.6; area 58.4,49.4 to 64.6,55.6
bRestrict: area 0.4,0.4 to 6.6,6.6; area 0.4,49.4 to 6.6,55.6; area 58.4,0.4 to 64.6,6.6; area 58.4,49.4 to 64.6,55.6

### Footprints (pad centres in the part's own frame; a part is rotated, then mirrored left to right if it is on the bottom)
ML414H_IV01E = smd 1 x 1: + 2.022,2.032 | smd 4.2 x 1.7: - 0.6,-1.85
0402 = smd 0.85 x 0.9: 1 -0.58,0; 2 0.58,0
LED-0603 = smd 1 x 1: A -0.877,0; C 0.877,0
SOD-323 = smd 0.63 x 0.83: A 1.15,0; C -1.15,0
SOT886 = smd 0.61 x 0.25: 1 -0.405,0.5 | smd 0.56 x 0.25: 2 -0.43,0; 3 -0.43,-0.5; 4 0.43,-0.5; 5 0.43,0; 6 0.43,0.5
SOT23-3 = smd 0.8 x 0.9: 1 -0.95,-1; 2 0.95,-1; 3 0,1.1
0402_MURATA = smd 0.4 x 0.7: P1 -0.4,0; P2 0.4,0
FIDUCIAL-MICRO = smd 0.635 x 0.635: 1 0,0
STAND-OFF-TIGHT = hole 3.048: 0,0
U.FL = smd 2.2 x 0.85: 1 0,1.375; 2 0,-1.375 | smd 1.05 x 1: FEED 1.525,0; NC -1.525,0
USB-C-16P = smd 0.3 x 1: A5 -1.25,-0.34; A6 -0.25,-0.34; A7 0.25,-0.34; A8 1.25,-0.34; B5 1.75,-0.34; B6 0.75,-0.34; B7 -0.75,-0.34; B8 -1.75,-0.34 | smd 0.6 x 1: GND -3.225,-0.34; GND2 3.225,-0.34; VBUS1 -2.45,-0.34; VBUS2 2.45,-0.34 | smd 1 x 2.1: SHLD1 -4.32,-0.915; SHLD2 4.32,-0.915 | smd 1 x 2.1 bottom: SHLD3 -4.32,-0.915; SHLD4 4.32,-0.915 | smd 1 x 1.6: SHLD5 -4.32,-5.095; SHLD8 4.32,-5.095 | smd 1 x 1.6 bottom: SHLD6 -4.32,-5.095; SHLD7 4.32,-5.095 | hole 0.65: -2.89,-1.445; 2.89,-1.445
1X06_NO_SILK = drill 1.016 pad 1.88: 1 0,0; 2 2.54,0; 3 5.08,0; 4 7.62,0; 5 10.16,0; 6 12.7,0
1X08_NO_SILK = drill 1.016 pad 1.88: 1 0,0; 2 2.54,0; 3 5.08,0; 4 7.62,0; 5 10.16,0; 6 12.7,0; 7 15.24,0; 8 17.78,0
JST04_1MM_RA = smd 0.6 x 1.35: 1 -1.5,0; 2 -0.5,0; 3 0.5,0; 4 1.5,0 | smd 1.2 x 2: NC1 2.8,-3.675; NC2 -2.8,-3.675
RASPBERRY_PI_HAT_40_PIN_SMD_STACKABLE_NOHOLES_NOREF = smd 1.27 x 3.175: 1 0,-1.46; 2 0,4; 3 2.54,-1.46; 4 2.54,4; 5 5.08,-1.46; 6 5.08,4; 7 7.62,-1.46; 8 7.62,4; 9 10.16,-1.46; 10 10.16,4; 11 12.7,-1.46; 12 12.7,4; 13 15.24,-1.46; 14 15.24,4; 15 17.78,-1.46; 16 17.78,4; 17 20.32,-1.46; 18 20.32,4; 19 22.86,-1.46; 20 22.86,4; 21 25.4,-1.46; 22 25.4,4; 23 27.94,-1.46; 24 27.94,4; 25 30.48,-1.46; 26 30.48,4; 27 33.02,-1.46; 28 33.02,4; 29 35.56,-1.46; 30 35.56,4; 31 38.1,-1.46; 32 38.1,4; 33 40.64,-1.46; 34 40.64,4; 35 43.18,-1.46; 36 43.18,4; 37 45.72,-1.46; 38 45.72,4; 39 48.26,-1.46; 40 48.26,4 | smd 1.02 x 1.87 bottom: 1B 0,-1.587; 2B 0,4.128; 3B 2.54,-1.587; 4B 2.54,4.128; 5B 5.08,-1.587; 6B 5.08,4.128; 7B 7.62,-1.587; 8B 7.62,4.128; 9B 10.16,-1.587; 10B 10.16,4.128; 11B 12.7,-1.587; 12B 12.7,4.128; 13B 15.24,-1.587; 14B 15.24,4.128; 15B 17.78,-1.587; 16B 17.78,4.128; 17B 20.32,-1.587; 18B 20.32,4.128; 19B 22.86,-1.587; 20B 22.86,4.128; 21B 25.4,-1.587; 22B 25.4,4.128; 23B 27.94,-1.587; 24B 27.94,4.128; 25B 30.48,-1.587; 26B 30.48,4.128; 27B 33.02,-1.587; 28B 33.02,4.128; 29B 35.56,-1.587; 30B 35.56,4.128; 31B 38.1,-1.587; 32B 38.1,4.128; 33B 40.64,-1.587; 34B 40.64,4.128; 35B 43.18,-1.587; 36B 43.18,4.128; 37B 45.72,-1.587; 38B 45.72,4.128; 39B 48.26,-1.587; 40B 48.26,4.128 | hole 1: 1.27,1.27; 46.99,1.27
SMT-JUMPER_2_NC_TRACE_SILK = smd 0.66 x 1.27: 1 -0.521,0; 2 0.521,0
SMT-JUMPER_2_NO_SILK = smd 0.635 x 1.27: 1 -0.406,0; 2 0.406,0
SMT-JUMPER_3_2-NC_TRACE_SILK = smd 0.66 x 1.27: 1 -1.041,0; 2 0,0; 3 1.041,0
0603 = smd 1.1 x 1: 1 -0.85,0; 2 0.85,0
1206_RA = smd 0.8 x 0.55: P1 -1.2,-0.62; P4 1.2,-0.62; P5 1.2,0.68; P8 -1.2,0.68 | smd 0.5 x 0.55: P2 -0.4,-0.62; P3 0.4,-0.62; P6 0.4,0.68; P7 -0.4,0.68
PAD.03X.04 = smd 1.016 x 1.016: P$1 0,0
UBLOX_ZED_F9R = smd 1.1 x 1.1: G1 -7.312,-5.37; G2 -5.212,-5.37; G3 -3.112,-5.37; G4 -1.012,-5.37; G5 1.088,-5.37; G6 3.188,-5.37; G7 5.288,-5.37; G8 7.388,-5.37; G9 7.388,-3.27; G10 5.288,-3.27; G11 3.188,-3.27; G12 1.088,-3.27; G13 -1.012,-3.27; G14 -3.112,-3.27; G15 -5.212,-3.27; G16 -7.312,-3.27; G17 -7.312,-1.17; G18 -5.212,-1.17; G19 -3.112,-1.17; G20 -1.012,-1.17; G21 1.088,-1.17; G22 3.188,-1.17; G23 5.288,-1.17; G24 7.388,-1.17; G25 7.388,0.93; G26 5.288,0.93; G27 3.188,0.93; G28 1.088,0.93; G29 -1.012,0.93; G30 -3.112,0.93; G31 -5.212,0.93; G32 -7.312,0.93; G33 -7.312,3.03; G34 -5.212,3.03; G35 -3.112,3.03; G36 -1.012,3.03; G37 1.088,3.03; G38 3.188,3.03; G39 5.288,3.03; G40 7.388,3.03; G41 7.388,5.13; G42 5.288,5.13; G43 3.188,5.13; G44 1.088,5.13; G45 -1.012,5.13; G46 -3.112,5.13; G47 -5.212,5.13; G48 -7.312,5.13 | smd 0.8 x 1.5: P1 -7.112,-7.62; P2 -6.012,-7.62; P3 -4.912,-7.62; P4 -3.812,-7.62; P5 -2.712,-7.62; P6 -1.612,-7.62; P7 -0.512,-7.62; P8 0.588,-7.62; P9 1.688,-7.62; P10 2.788,-7.62; P11 3.888,-7.62; P12 4.988,-7.62; P13 6.088,-7.62; P14 7.188,-7.62; P28 7.188,7.33; P29 6.088,7.33; P30 4.988,7.33; P31 3.888,7.33; P32 2.788,7.33; P33 1.688,7.33; P34 0.588,7.33; P35 -0.512,7.33; P36 -1.612,7.33; P37 -2.712,7.33; P38 -3.812,7.33; P39 -4.912,7.33; P40 -6.012,7.33; P41 -7.112,7.33 | smd 1.5 x 0.8: P15 9.988,-6.77; P16 9.988,-5.67; P17 9.988,-4.57; P18 9.988,-3.47; P19 9.988,-2.37; P20 9.988,-1.27; P21 9.988,-0.17; P22 9.988,0.93; P23 9.988,2.03; P24 9.988,3.13; P25 9.988,4.23; P26 9.988,5.33; P27 9.988,6.43; P42 -9.912,6.43; P43 -9.912,5.33; P44 -9.912,4.23; P45 -9.912,3.13; P46 -9.912,2.03; P47 -9.912,0.93; P48 -9.912,-0.17; P49 -9.912,-1.27; P50 -9.912,-2.37; P51 -9.912,-3.47; P52 -9.912,-4.57; P53 -9.912,-5.67; P54 -9.912,-6.77
SOP_8-PIN = smd 1.9 x 0.64: P1 -2.921,2.032; P2 -2.921,0.762; P3 -2.921,-0.508; P4 -2.921,-1.778; P5 2.679,-1.778; P6 2.679,-0.508; P7 2.679,0.762; P8 2.679,2.032
SIP6 = smd 0.3 x 0.52: P1 -0.508,-0.381; P2 -0.008,-0.381; P3 0.492,-0.381; P4 0.492,0.369; P5 -0.008,0.369; P6 -0.508,0.369

### Placement (x,y rotation side)
BT1  55.06,44.69 90 top
C1  36.1,42.63 0 top
C2  31.76,43.6 0 top
C3  31.87,21.44 0 top
C4  23.03,18.09 90 top
C5  13.19,14.37 0 top
C6  13.7,25.57 0 top
C7  21.67,11.13 270 top
C8  18.37,11.13 270 top
D1  10.07,4 180 top
D2  14.57,4 0 top
D3  19.37,4 180 top
D4  24.16,3.81 180 top
D5  45.45,46.63 180 top
D6  52.27,9.31 90 top
D7  13.19,16.84 180 top
D8  13.19,23.22 180 top
FB1  29.63,22.97 0 top
FD1  63,7.9 90 top
FD2  63,7.9 270 bottom
FD3  5.07,48.51 0 top
FD4  5.07,48.51 0 bottom
FRAME1  1.8,-16.26 0 top  (outside the outline)
H1  61.53,3.5 0 top
H2  3.53,3.5 0 top
H3  3.53,52.5 0 top
H4  61.53,52.5 0 top
J1  29.03,14.41 90 top
J2  52.53,6.18 0 top
J3  32.28,1.5 0 top
J4  7.03,35.55 270 top
J5  5.36,42.42 270 top
J6  8.4,51.22 0 top
JP1  9.77,7.68 270 top
JP2  14.79,7.68 270 top
JP3  19.17,7.68 270 top
JP4  23.74,7.68 270 top
JP5  15,41.02 180 top
JP6  11.03,41.09 180 top
LOGO1  3.03,47 0 top
LOGO2  4.03,11 0 top
LOGO3  56.07,24.26 90 top
R1  31.76,42.23 180 top
R2  33.16,22.97 0 top
R3  20,30.35 270 top
R4  20.03,34 180 top
R5  20,36.7 270 top
R6  49.03,36.7 270 top
R7  49.03,31.5 270 top
R8  9.99,38.64 90 top
R9  9.92,5.46 180 top
R10  14.73,5.46 0 top
R11  19.21,5.46 180 top
R12  24.16,5.46 180 top
R13  12.03,38.46 90 top
R14  47.72,10 270 top
R15  49.26,10 270 top
R16  49.65,46.57 180 top
R17  53.44,13.02 90 top
R18  51.88,13.02 90 top
R19  13.32,27.07 0 top
R20  13.19,19.28 0 top
R21  21.28,15.26 0 top
R22  17.89,15.26 180 top
R23  13.19,12.85 0 top
R24  13.19,20.78 0 top
TP1  14,46.99 270 bottom
TP2  16.54,46.99 270 bottom
TP3  17.81,44.45 270 bottom
TP4  15.27,44.45 270 bottom
TP5  6.38,46.99 0 bottom
TP6  19.08,10.16 270 bottom
TP7  16.54,10.16 270 bottom
U1  35.03,33 0 top
U2  19.33,20.28 270 top
U3  21.16,13.23 180 top
U4  17.81,13.23 180 top
U$1  [INT1]  7.4,30.48 0 top
U$2  [PPS4]  7.33,27.94 0 top
U$3  [PPS6]  12.47,2.31 0 top
U$4  [PWR7]  7.39,2.31 0 top
U$5  [RTK5]  16.91,2.31 0 top
U$6  [RXI28]  39.88,6.72 270 top
U$7  [#RESET1]  7.2,35.56 0 top
U$8  [#RESET2]  13.15,35.56 0 bottom
U$9  [SFE_LOGO_NAME_FLAME_.3]  34.32,34.29 0 bottom
U$10  [TXO21]  42.42,7.65 270 top
U$11  [INT2]  11.66,30.48 0 bottom
U$12  [PPS1]  11.74,27.94 0 bottom
U$13  [#SAFEBOOT0]  7.08,33.02 0 top
U$14  [RXI26]  39.88,1.76 90 bottom
U$15  [#SAFEBOOT3]  15.78,33.02 0 bottom
U$16  [TXO25]  42.42,1.76 90 bottom
U$17  [BLK2]  30.51,3.3 270 top
U$18  [GND-04]  32.28,6.59 270 top
U$19  [GND-04]  32.28,1.76 90 bottom
U$20  [I_SUPER2_C-()-04]  9.07,43.1 0 top
U$21  [ANT1]  26.44,11.2 0 top
U$22  [D#0]  7.27,20.33 0 top
U$23  [D#1]  7.2,17.78 0 top
U$24  [SPI0]  13.07,43.08 0 top
U$25  [GPS_DEAD_RECKONING0]  59.72,10.16 90 top
U$26  [ZED#F9R0]  62.82,15.74 90 top
U$27  [W#2]  7.35,25.4 0 top
U$28  [W#3]  7.23,22.86 0 top
U$29  [GEO0]  21.53,2.3 0 top
U$30  [GRN1]  46.76,3.43 270 top
U$31  [DEAD#RECKONING#GPS#BOARD#SILK#FINAL#JPG]  61.24,42.04 90 top
U$32  [D#0]  10.78,17.78 0 bottom
U$33  [D#1]  10.67,20.33 0 bottom
U$34  [W#2]  11.3,25.4 0 bottom
U$35  [W#3]  11.13,22.86 0 bottom
U$36  [DEAD#RECKONING#GPS#BOARD#SILK#FINAL#JPG]  33.94,26.16 0 bottom

### Tracks (layer width: path | path; a pad name or v marks a point on that pad's centre or on a via)
3.3V  (via drill 0.35, 0.38, 0.51)  (1 unrouted)
  Top 0.254: JP6.2 11.03,43.1 12.3,44.37 v13.03,44.37 | D1.A 11.67,4.72 11.67,6.68 11.66,6.68 v11.66,7.7 11.76,7.8 11.76,8.09 16.63,12.95 v16.63,13 16.63,14.84 R22.2 | v8.41,52.07 8.41,49.77 J6.1 | J6.17 28.72,51.31 v28.22,51.81 | U2.P8 22.94,17.61 C4.1 24.03,16.51 24.03,14.53 23.49,13.99 | 23.49,13.99 v22.81,13.31 22.38,12.88 21.68,12.88 U3.P6 C7.1 | R21.2 23.39,13.99 23.49,13.99 | v19.33,12.85 19.32,12.86 U4.P6 18.32,11.84 arc45 C8.1
  Top 0.508: v8.42,44.37 8.42,43.83 7.51,42.92 J5.2 | R1.2 31.18,40.36 U1.P38 | U1.P34 35.52,40.43 35.52,41.63 | 35.52,41.63 C1.1 35.57,42.69 35.57,44.47 v35.51,44.52 | U1.P33 36.71,41.31 36.4,41.63 35.52,41.63 | R1.2 31.04,42.37 | v46.1,44.55 46.1,44.73 44.3,46.53 D5.A | R1.2 C2.1 31.13,43.66 v31.13,44.58
  Bottom 0.254: 11.03,44.37 11.03,33 15.66,28.37 15.66,13.6 11.76,9.7 11.76,7.8 v11.66,7.7 | J6.1B v8.4,52.06 v8.41,52.07 | v28.22,51.81 28.22,50.13 J6.17B | v22.81,13.31 22.35,12.85 v19.33,12.85 16.78,12.85 v16.63,13
  Bottom 0.508: v46.1,44.55 46.08,44.58 35.56,44.58 v35.51,44.52 35.46,44.58 v31.13,44.58 31.1,44.6 19.39,44.6 18.24,43.46 14.05,43.46 13.13,44.37 v13.03,44.37 11.03,44.37 v8.42,44.37 8.4,44.4 8.4,46.99 | 8.4,46.99 J6.1B | 8.4,46.99 TP5.P$1
5V  (via drill 0.38)
  Top 0.254: J6.4 9.81,55.22 | 9.81,55.22 v9.68,55.34 | J6.2 9.81,55.22
  Bottom 0.254: J6.2B v9.68,55.34 J6.4B
!RESET
  Top 0.254: J4.1 11.02,31.55 R3.P1
!SAFEBOOT
  Top 0.254: J4.2 9.28,30.75 R3.P2
CE1  (via drill 0.38)
  Top 0.254: v37.62,55.37 38.72,55.37 J6.26
  Bottom 0.254: J6.26B 37.65,55.34 v37.62,55.37
D_SEL  (via drill 0.38)
  Top 0.254: v23.72,33.98 23.76,33.93 U1.P47 | v16.88,34.25 15.46,35.67 15.46,40.97 JP5.1
  Bottom 0.254: v23.72,33.98 17.15,33.98 v16.88,34.25
DIR+
  Top 0.254: R20.1 10.15,19.28 9.12,20.31 J4.7
DIR_IN  (via drill 0.38)
  Top 0.254: v17.58,19.98 17.38,19.78 15.39,17.8 15.39,13.32 14.92,12.85 R23.2 | U2.P4 17.58,23.19 v17.58,21.24
  Bottom 0.254: v17.58,21.24 v17.58,19.98
DIR_OUT  (via drill 0.38)
  Top 0.254: v26.28,4 38.53,4 40.63,6.1 40.63,20.4 43.13,22.9 49.23,22.9 50.63,24.3 v50.63,29.2 | v17.28,11.32 17.32,11.36 U4.P4 | R6.P6 51.2,36.3 v51.58,35.93
  Bottom 0.254: v51.58,35.93 51.63,35.88 51.63,30.2 v50.63,29.2 | 17.28,10.16 17.28,4.59 17.87,4 v26.28,4 | 17.28,10.16 v17.28,11.32 | TP7.P$1 17.28,10.16
DIR_SCHMITT
  Top 0.254: U4.P2 17.82,14.33 R22.1 18.74,17.52 U2.P6
DMINUS
  Top 0.254: U1.P39 30.11,44.62 30.77,45.28 42.95,45.28 46.13,42.1 50.03,42.1 53.66,38.47 53.66,16.53 51.88,14.76 R18.2
DPLUS
  Top 0.254: U1.P40 29.01,44.17 30.63,45.8 43.55,45.8 45.93,43.42 45.93,43.4 46.63,42.7 50.31,42.7 54.06,38.95 54.06,15.38 53.44,14.76 R17.2
GEOF_STAT
  Top 0.254: D4.A 25.03,3.69 25.28,3.45 38.73,3.45 41.23,5.95 41.23,20.3 43.23,22.3 49.53,22.3 51.23,24 51.23,31.35 50.68,31.9 R7.P7
GND  (via drill 0.3)
  Top 0.254: D6.2 52.27,8.01 v52.53,7.75 | U4.P3 17.32,14.21 v17.23,14.3
  other vias: 26.79,39.09 28.7,39.04 30.79,39.04 32.89,39.04 35,39.04 37.11,39.04 39.19,39.04 41.3,39.01 43.49,39.07 26.49,37.26 28.7,37.26 30.79,37.26 32.89,37.26 35,37.26 37.11,37.26 39.19,37.26 41.3,37.24 43.49,37.29 26.49,35.08 28.7,35.08 30.79,35.08 32.89,35.08 35,35.08 37.11,35.08 39.19,35.08 41.3,35.05 43.49,35.1 26.49,32.99 28.7,32.99 30.79,32.99 32.89,32.99 35,32.99 37.11,32.99 39.19,32.99 41.3,32.97 43.49,33.02 26.49,30.86 28.7,30.86 30.79,30.86 32.89,30.86 35,30.86 37.11,30.86 39.19,30.86 41.3,30.84 43.49,30.89 26.47,28.83 28.68,28.83 30.76,28.83 32.87,28.83 34.98,28.83 37.09,28.83 39.17,28.83 41.28,28.8 43.46,28.85 26.89,26.6 28.7,26.72 30.79,26.9 32.89,26.9 35,26.9 37.11,26.9 39.19,26.9 41.3,26.87 43.49,26.62 57.03,25 57.03,22 57.03,19 57.03,16 57.03,13 57.03,10 60.03,22 60.03,19 60.03,16 60.03,13 60.03,10 60.03,7 33.03,19 36.03,19 33.03,16 36.03,16 33.03,13 36.03,13 33.03,10 36.03,10 33.03,7 36.03,7 39.03,19 39.03,16 39.03,13 39.03,10 39.03,7 26.73,15.69 27.73,12.59 36.03,22 39.03,22 45.03,24 28.93,11.79 27.78,21.52 27.83,18.89 27.83,16.19 26.63,13.69 31.43,13.69 31.33,15.69 30.23,16.19 30.2,21.52 30.33,12.69 27.81,23.89 2.03,16 5.03,16 2.03,13 5.03,13 2.03,10 5.03,10 2.03,7 5.03,7 13.23,38 13.03,41 3.03,38 13.03,43 9.03,35 24.03,43 27.03,43 38.03,42 41.03,42 44.03,42 38.03,47 41.03,47 53.03,43 57.03,42 57.03,40 60.03,43 63.03,43 60.03,46 63.03,46 60.03,28 60.03,31 57.03,31 57.03,34 12.18,46.75 12.23,49.55 62.52,13.25 63.03,9.87 63.03,7 1.03,38 1.03,49 6.03,49 6.03,46 3.03,44 3.03,41 43.49,25.72 43.49,24.92 26.89,25.8 26.89,24.95 26.79,40.04 26.79,41.04 27.7,39.09 27.7,26.65 42.39,26.62 28.98,14.4 30.25,23.98 30.2,20.12 27.03,1 24.03,1 21.03,1 18.03,1 15.03,1 12.03,1 9.03,1 6.03,1 42.03,24 39.03,24 36.03,24 5.03,19 2.03,18 60.03,25 57.03,28 60.03,34 60.03,37 57.03,37 60.03,40 63.03,22 63.03,19 63.03,16 63.03,28 63.03,31 63.03,25 63.03,34 63.03,37 63.03,40 47.03,13 63.03,49 60.03,49 55.03,46 55.03,44 54.03,10 57.03,7 48.53,7.25 46.78,1 46.78,4 46.78,7 26.63,14.69 31.43,14.69 26.83,12.89 31.23,12.89 29.75,26.64 30.03,1 11.03,29 17.03,29 13.03,35 14.83,37.95 15.03,35 22.03,41 47.03,29 47.03,27 47.03,25 49.03,25 49.03,27 49.03,29 52.83,19 50.03,19 47.03,19 47.03,16 50.03,16 52.19,16 49.83,13 47.03,41 50.03,41 22.99,32.99 55.03,25 55.03,22 55.03,19 55.03,16 55.03,13 55.03,10 55.03,31 55.03,34 55.03,28 55.03,37 55.03,40 58.03,49 58.03,51 53.03,52.5 50.03,52.5 47.03,52.5 44.03,52.5 41.03,52.5 38.03,52.5 35.03,52.5 32.03,52.5 29.03,52.5 26.03,52.5 23.03,52.5 20.03,52.5 15.03,52.5 12.03,52.5 59.03,56 5.03,56 15.14,45.79 30.03,10 30.03,7 17.88,19.1 27.03,10 27.03,7 24.03,10 25.03,13 25.03,16 25.03,19 25.03,22 23.03,22 23.03,20 27.83,20.19 27.83,17.49 30.2,18.92 30.23,17.49 27.78,22.72 31.75,24.18 8.03,10 8.03,13 11.03,13 11.03,10 25.03,25 23.03,25 20.03,25 17.03,25 17.03,27 20.03,27 11.03,16 9.03,16 9.03,39 6.03,39 19.53,14 11.03,23 18.38,9.55 21.69,9.43 33.33,43.15 14.08,16.65 14.03,23.2 19.43,21.55 9.03,23 11.03,25
  pour Top (isolate 0.305, rank 3): 62.03,0 arc90 65.03,3 65.03,53.5 arc90 61.26,57.26 3.79,57.26 arc90 0.03,53.5 0.03,3 arc90 3.03,0
  pour Bottom (isolate 0.305, rank 3): 3.03,0 arc-90 0.03,3 0.03,53.5 arc-90 3.79,57.26 61.26,57.26 arc-90 65.03,53.5 65.03,3 arc-90 62.03,0
GP4  (via drill 0.38)
  Top 0.254: J6.7 16.02,51.81 v16.03,51.82
  Bottom 0.254: v16.03,51.82 16.03,49.64 J6.7B
GP6  (via drill 0.38)
  Top 0.254: J6.31 46.5,51.81 v46.51,51.82
  Bottom 0.254: v46.51,51.82 46.51,49.64 J6.31B
GP12  (via drill 0.38)
  Top 0.254: v45.24,55.37 46.34,55.37 J6.32
  Bottom 0.254: J6.32B 45.27,55.34 v45.24,55.37
GP13  (via drill 0.38)
  Top 0.254: J6.33 49.04,51.81 v49.05,51.82
  Bottom 0.254: v49.05,51.82 49.05,49.64 J6.33B
GP16  (via drill 0.38)
  Top 0.254: J6.36 50.42,55.22 v50.32,55.12
  Bottom 0.254: J6.36B 51.35,55.12 v50.32,55.12
GP17  (via drill 0.38)
  Top 0.254: J6.11 21.1,51.81 v21.11,51.82
  Bottom 0.254: v21.11,51.82 21.11,49.64 J6.11B
GP18  (via drill 0.38)
  Top 0.254: v19.84,55.37 20.94,55.37 J6.12
  Bottom 0.254: J6.12B 19.87,55.34 v19.84,55.37
GP19  (via drill 0.38)
  Top 0.254: J6.35 51.58,51.81 v51.59,51.82
  Bottom 0.254: v51.59,51.82 51.59,49.64 J6.35B
GP20  (via drill 0.38)
  Top 0.254: J6.38 54.02,55.12 v52.86,55.12
  Bottom 0.254: J6.38B 53.89,55.12 v52.86,55.12
GP21  (via drill 0.38)
  Top 0.254: J6.40 56.76,55.12 v57.94,55.12
  Bottom 0.254: v57.94,55.12 56.88,55.12 J6.40B
GP22  (via drill 0.38)
  Top 0.254: J6.15 26.18,51.28 v26.7,51.8
  Bottom 0.254: v26.7,51.8 26.7,50.15 J6.15B
GP23  (via drill 0.38)
  Top 0.254: v24.92,55.37 26.02,55.37 J6.16
  Bottom 0.254: J6.16B 24.95,55.34 v24.92,55.37
GP24  (via drill 0.38)
  Top 0.254: J6.18 28.62,55.12 28.37,55.37 v27.46,55.37
  Bottom 0.254: J6.18B 27.49,55.34 v27.46,55.37
GP25  (via drill 0.38)
  Top 0.254: v32.54,55.37 33.64,55.37 J6.22
  Bottom 0.254: J6.22B 32.57,55.34 v32.54,55.37
GP26  (via drill 0.38)
  Top 0.254: J6.37 52.89,49.76 v52.86,49.78
  Bottom 0.254: J6.37B 53.96,49.78 v52.86,49.78
GP27  (via drill 0.38)
  Top 0.254: J6.13 23.64,51.81 v23.65,51.82
  Bottom 0.254: v23.65,51.82 23.65,49.64 J6.13B
ID_SC  (via drill 0.38)
  Top 0.254: v40.16,55.37 41.26,55.37 J6.28
  Bottom 0.254: J6.28B 40.19,55.34 v40.16,55.37
ID_SD  (via drill 0.38)
  Top 0.254: J6.27 41.42,51.81 v41.43,51.82
  Bottom 0.254: v41.43,51.82 41.43,49.64 J6.27B
INT
  Top 0.254: J4.3 7.54,29.95 R3.P3
N$1
  Top 0.254: JP6.1 12.07,39.35 R13.2
N$2
  Top 0.508: D5.C 48.73,46.63 R16.2
N$3
  Top 0.254: JP6.3 R8.2
N$4
  Top 0.254: R9.2 9.07,4.13 D1.C
N$5
  Top 0.381: R2.1 31.23,22.97 | 31.23,22.97 FB1.P2 | C3.1 arc-45 31.23,21.6 31.23,22.97
N$6
  Top 0.254: D6.6 51.77,12.05 R18.1
N$7
  Top 0.254: D6.4 52.77,10.39 53.44,11.05 R17.1
N$8
  Top 0.254: JP1.2 10.59,7.16 10.77,6.98 R9.1
N$9
  Top 0.254: D6.3 52.77,8.63 53.28,8.12 J2.B6 53.28,4.99 52.99,4.7 52.6,4.7 52.28,5.03 J2.A6
N$10  (via drill 0.35)
  Top 0.254: J2.VBUS2 54.98,6.8 v54.78,7 | v51.03,8 50.08,7.05 J2.VBUS1 | D6.5 52.27,10.74 v52.53,11
  Bottom 0.254: v54.78,7 52.03,7 v51.03,8 51.03,9.5 v52.53,11
N$11
  Top 0.254: J2.A7 52.78,6.81 52.6,6.99 51.78,6.99 | J2.B7 51.78,6.99 | 51.78,6.99 D6.1
N$12  (via drill 0.35)
  Top 0.254: J2.B5 54.28,4.25 53.53,3.5 50.78,3.5 v50.53,3.75 | v49.03,8 48.53,8 47.72,8.8 R14.2
  Bottom 0.254: v50.53,3.75 50.53,6.5 v49.03,8
N$13
  Top 0.254: U1.P49 20.86,31.73 R3.P8
N$14
  Top 0.254: U1.P51 23.07,29.53 22.65,29.95 R3.P6
N$15
  Top 0.254: R5.P6 21.72,36.3 22.65,37.23 U1.P44
N$16
  Top 0.254: R12.1 25.01,6.52 24.36,7.16 JP4.2
N$17
  Top 0.254: D4.C 23.28,5.43 R12.2
N$18  (via drill 0.35)
  Top 0.254: J2.A5 v51.28,4.5 | R15.2 49.26,8.82 49.78,8.3 v49.78,8.25
  Bottom 0.254: v51.28,4.5 51.28,6.75 v49.78,8.25
N$19
  Top 0.254: U1.P45 22.36,36.13 21.73,35.5 21.72,35.5 R5.P5
N$20
  Top 0.254: U1.P46 22.66,35.03 21.63,34 R4.1
N$21
  Top 0.254: R5.P8 21.29,37.9 22.82,39.43 U1.P42
N$22
  Top 0.254: R11.1 20.06,7.01 19.92,7.16 JP3.2
N$23
  Top 0.254: R10.1 13.88,6.99 14.05,7.16 JP2.2
N$24
  Top 0.254: D2.C 15.52,4.07 15.52,5.4 R10.2
N$25
  Top 0.254: R11.2 18.49,5.33 D3.C
N$26
  Top 0.254: R5.P7 21.38,37.1 22.61,38.33 U1.P43
N$27
  Top 0.254: R19.2 13.96,27.07 13.96,27.01 13.12,26.18 C6.1 13.12,24.16 13.19,24.09 D8.3 13.19,21.63 R24.1
N$28
  Top 0.254: U1.P19 46.56,30.63 46.71,30.79 46.93,31 47.82,31.9 R7.P2
N$29
  Top 0.254: U1.P20 46.7,31.73 47.57,32.6 48.31,32.6 R7.P1
N$30
  Top 0.254: U1.P53 22.89,27.33 21.06,29.15 R3.P5
N$31
  Top 0.254: U1.P50 22.99,30.63 22.87,30.75 R3.P7
N$32
  Top 0.254: U1.P27 46.07,39.43 47.59,37.9 R6.P1
N$33
  Top 0.254: U1.P26 46.15,38.33 47.38,37.1 R6.P2
N$34
  Top 0.254: U1.P22 46.15,33.93 47.72,35.5 R6.P4
N$35
  Top 0.254: U1.P23 45.98,35.03 47.25,36.3 R6.P3
N$36
  Top 0.254: R20.2 14.04,19.13 13.19,18.28 D7.3 12.61,15.16 C5.1 12.34,14.37 R23.1
PPS  (via drill 0.38)
  Top 0.254: D2.A 12.86,4 12.3,4.56 v12.3,6.67 | J4.4 7.1,28 v16.32,28 v16.31,28.01 17.24,28.01 18.38,29.15 R3.P4
  Bottom 0.254: v12.3,6.67 12.3,9.47 16.24,13.4 16.24,27.93 v16.31,28.01
QWIIC_SCL  (via drill 0.38)
  Top 0.254: R8.1 9.77,37.56 6.39,37.56 4.57,39.38 4.57,40.46 5.03,40.92 J5.4 8.09,40.92 13.48,46.3 J6.5 13.48,51.81 v13.49,51.82
  Bottom 0.254: v13.49,51.82 13.49,49.64 J6.5B
QWIIC_SDA  (via drill 0.38)
  Top 0.254: R13.1 11.26,36.84 6.38,36.84 4.03,39.2 4.03,41 4.94,41.92 J5.3 8.21,41.92 11.03,44.74 11.03,49.67 J6.3 10.94,51.81 v10.95,51.82
  Bottom 0.254: v10.95,51.82 10.95,49.64 J6.3B
RF_IN
  Top 1: J1.FEED 29.03,22.05
  pour Top (no thermals): 28.58,25.1 29.48,25.1 29.48,21.86 28.58,21.86
RTK_STAT
  Top 0.254: D3.A 20.25,3.78 21.08,2.95 39.28,2.95 41.73,5.4 41.73,20 43.53,21.8 49.93,21.8 51.83,23.7 51.83,32 51.13,32.7 R7.P8
RXI2
  Top 0.254: J3.4 39.9,1.87 42.28,4.25 42.28,19.75 43.78,21.25 50.38,21.25 52.43,23.3 52.43,35.56 52.43,36.09 52.43,36.26 51.58,37.1 R6.P7
RXI/MOSI  (via drill 0.38)
  Top 0.254: v21.34,47.34 21.34,43.71 18.03,40.4 18.03,37.63 18.19,37.47 18.31,37.34 18.55,37.1 R5.P2 | J6.19 31.26,51.81 v31.27,51.82 | J6.8 14.86,55.22 v14.76,55.12
  Bottom 0.254: 17.28,48 17.93,47.34 v21.34,47.34 30.03,47.34 31.26,48.58 31.26,49.53 | 31.26,49.53 J6.19B | 17.28,48 17.28,52.47 15.91,53.84 15.91,55.24 | 17.28,48 17.27,48.01 15.77,48.01 14.76,46.99 TP1.P$1 | v31.27,51.82 31.27,49.54 31.26,49.53 | v14.76,55.12 15.79,55.12 15.91,55.24 | 15.91,55.24 J6.8B
SCL/CLK  (via drill 0.38)
  Top 0.254: v19.58,45.47 19.58,43.76 16.63,40.8 16.63,37.4 18.53,35.5 R5.P4 | v36.35,51.82 36.35,49.77 J6.23
  Bottom 0.254: TP3.P$1 17.81,44.7 18.57,45.47 v19.58,45.47 19.62,45.5 33.53,45.5 36.34,48.31 J6.23B 36.34,51.81 v36.35,51.82
SDA/!CS  (via drill 0.38)
  Top 0.254: v20.52,46.12 20.42,46.02 20.42,43.9 17.23,40.7 17.23,37.54 18.46,36.3 R5.P3 | J6.24 35.23,55.22 v35.08,55.37
  Bottom 0.254: TP4.P$1 16.46,44.45 18.13,46.12 v20.52,46.12 33.15,46.12 35.03,48 35.03,51.5 36.34,52.81 J6.24B 35.11,55.34 v35.08,55.37
SHIELD  (via drill 0.38)
  other vias: 49.65,3.35 55.26,3.43 49.65,1.22 55.16,1.27
  pour Top: 57.52,5.84 47.66,5.84 47.66,-0.02 57.52,-0.02
  pour Bottom: 57.29,-0.02 47.66,-0.02 47.66,5.84 57.29,5.84
TX_READY  (via drill 0.35, 0.38)
  Top 0.254: J6.29 v43.96,51.79 v43.97,51.8 | R4.2 18.78,34 16.03,36.75 v16.03,42.8
  Bottom 0.254: v43.97,51.8 43.97,49.64 J6.29B 43.96,48.47 46.88,45.55 46.88,44.25 46.5,43.88 19.75,43.88 18.68,42.8 17.53,42.8 v16.03,42.8
TXO2
  Top 0.254: J3.5 42.94,2 42.94,19.66 44.03,20.75 50.98,20.75 53.03,22.8 53.03,36.73 51.85,37.9 R6.P8
TXO/MISO  (via drill 0.35, 0.38)
  Top 0.254: v18.03,46.75 17.28,47.5 17.28,54.84 v17.3,54.86 18.21,54.86 J6.10 | v22.33,46.76 22.33,43.85 19.3,40.83 19.3,37.98 R5.P1 | J6.21 33.8,51.81 v33.81,51.82
  Bottom 0.254: 33.8,49.53 33.8,47.77 32.79,46.76 v22.33,46.76 v18.04,46.76 v18.03,46.75 16.78,46.75 TP2.P$1 | 33.8,49.53 J6.21B | v33.81,51.82 33.81,49.54 33.8,49.53 | v17.3,54.86 18.08,54.86 J6.10B
V_BATT  (via drill 0.35, 0.38)
  Top 0.254: v34.54,43.28 33.41,42.16 U1.P36 | BT1.+ 52.89,46.57 R16.1 50.53,46.54 50.53,45.5 v50.03,45
  Bottom 0.254: v34.54,43.28 46.91,43.28 48.63,45 v50.03,45
V_RF
  Top 0.508: U1.P7 34.51,23.48 R2.2
WT+
  Top 0.254: R19.1 10.44,27.07 8.77,25.39 J4.5
WT_IN
  Top 0.254: U2.P1 21.37,21.97 19.96,20.56 14.27,20.56 R24.2
WT_OUT  (via drill 0.38)
  Top 0.254: v50.03,28.5 50.03,24.6 48.83,23.4 42.83,23.4 40.03,20.6 40.03,6.2 38.43,4.6 v27.03,4.6 | U3.P4 20.67,11.35 v20.69,11.32 | R6.P5 50.63,35.5 51.03,35.11 v51.03,34.2
  Bottom 0.254: v27.03,4.6 21.19,4.6 20.69,5.1 20.69,10.16 | v50.03,28.5 50.03,29.5 51.03,30.5 v51.03,34.2 | v20.69,11.32 20.69,10.16 | TP6.P$1 20.69,10.16
WT_SCHMITT
  Top 0.254: U2.P7 20.1,15.59 R21.1 21.17,14.51 U3.P2

### Text on the board
Bottom: v10
tPlace: - | + | Z | Y | X
bPlace: Z | Y | X
tDocu: Elias Santistevan